# EAGLE schematic raspberry (EAGLE 9.6.2)
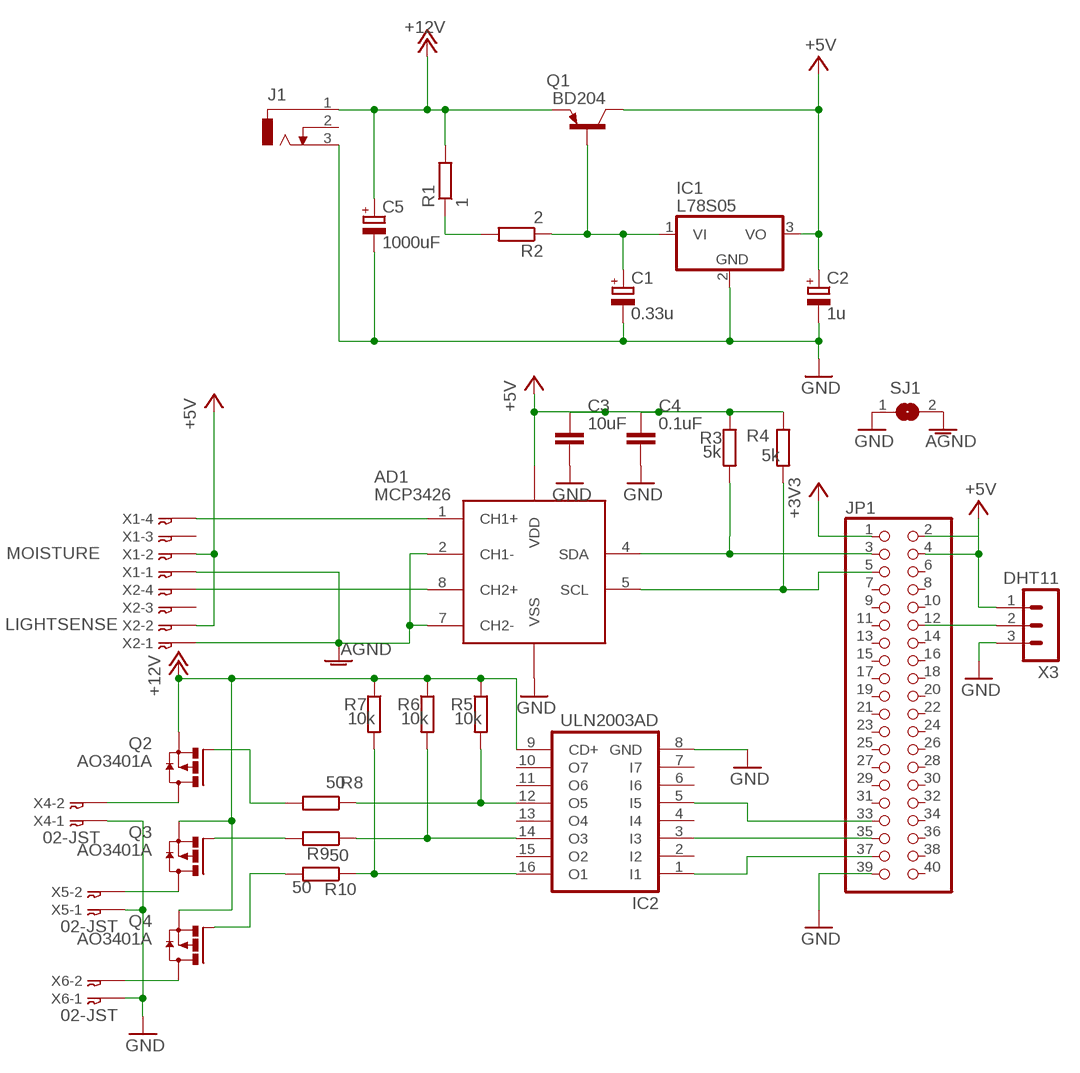
[diagram p0: schematic, sheet 1]

## Parts
AD1  MCP3426  MCP3426A0-E/SN  [SO-8]
C1  0.33u  CPOL-EUE1.8-4  [E1,8-4]
C2  1u  CPOL-EUE2-4  [E2-4]
C3  10uF  C_TANTALUM-1206(3216-METRIC)  [CAPM3216X180]
C4  0.1uF  C_CHIP-0805(2012-METRIC)  [CAPC2012X110]
C5  1000uF  CPOL-EUE5-13  [E5-13]
IC1  L78S05  7805TV  [TO220V]
IC2  ULN2003AD  [SO16]
J1  DCJ0303  [DCJ0303]
JP1  PINHD-2X20  [2X20]
Q1  BD204  -PNP-TO220V  [TO220V]
Q2  AO3401A  [SOT23]
Q3  AO3401A  [SOT23]
Q4  AO3401A  [SOT23]
R1  1  R-EU_R0805W  [R0805W]
R2  2  R-EU_R0805W  [R0805W]
R3  5k  R-EU_R0805W  [R0805W]
R4  5k  R-EU_R0805W  [R0805W]
R5  10k  R-EU_R0805W  [R0805W]
R6  10k  R-EU_R0805W  [R0805W]
R7  10k  R-EU_R0805W  [R0805W]
R8  50  R-EU_R0805W  [R0805W]
R9  50  R-EU_R0805W  [R0805W]
R10  50  R-EU_R0805W  [R0805W]
SJ1  SJ  [SJ]
X1  MOISTURE  04-JST-B4B-XH-A  [B4B-XH]
X2  LIGHTSENSE  04-JST-B4B-XH-A  [B4B-XH]
X3  DHT11  MA03-1  [MA03-1]
X4  02-JST  [B2B-XH]
X5  02-JST  [B2B-XH]
X6  02-JST  [B2B-XH]

## Nets
+3V3: JP1.1
+5V: AD1.3(VDD) C2.+ C3.1 C4.1 IC1.3(VO) JP1.2 JP1.4 Q1.2(C) R3.1 R4.1 X1.P$2 X2.P$2 X3.1
+12V: C5.+ IC2.9(CD+) J1.1 Q1.3(E) Q2.2(S) Q3.2(S) Q4.2(S) R1.2 R5.1 R6.1 R7.1
AGND: AD1.2(CH1-) AD1.7(CH2-) SJ1.2 X1.P$1 X2.P$1
GND: AD1.6(VSS) C1.- C2.- C3.2 C4.2 C5.- IC1.2(GND) IC2.8(GND) J1.3 JP1.39 SJ1.1 X3.3 X4.P$1 X5.P$1 X6.P$1
GPIO18-DHT11-DATA: JP1.12 X3.2
N$1: R1.1 R2.2
N$2: AD1.4(SDA) JP1.3 R3.2
N$3: C1.+ IC1.1(VI) Q1.1(B) R2.1
N$4: AD1.5(SCL) JP1.5 R4.2
N$5: AD1.8(CH2+) X2.P$4
N$6: AD1.1(CH1+) X1.P$4
N$7: IC2.1(I1) JP1.37
N$8: Q3.3(D) X5.P$2
N$9: Q4.3(D) X6.P$2
N$10: IC2.3(I3) JP1.35
N$11: Q2.3(D) X4.P$2
N$12: IC2.16(O1) R7.2 R10.1
N$13: Q2.1(G) R8.2
N$14: IC2.5(I5) JP1.33
N$15: Q3.1(G) R9.2
N$16: IC2.12(O5) R5.2 R8.1
N$17: IC2.14(O3) R6.2 R9.1
N$18: Q4.1(G) R10.2
Unconnected: IC2.2(I2) IC2.4(I4) IC2.6(I6) IC2.7(I7) IC2.10(O7) IC2.11(O6) IC2.13(O4) IC2.15(O2) J1.2 JP1.6 JP1.7 JP1.8 JP1.9 JP1.10 JP1.11 JP1.13 JP1.14 JP1.15 JP1.16 JP1.17 JP1.18 JP1.19 JP1.20 JP1.21 JP1.22 JP1.23 JP1.24 JP1.25 JP1.26 JP1.27 JP1.28 JP1.29 JP1.30 JP1.31 JP1.32 JP1.34 JP1.36 JP1.38 JP1.40 X1.P$3 X2.P$3

## Library data of the parts
AD1 = Custom_Library:MCP3426A0-E/SN
C1 C2 C5 = rcl:CPOL-EU: POLARIZED CAPACITOR, European symbol; SPICEPREFIX: C
C3 C4 = Capacitor:C: Capacitor - Generic; CATEGORY: Capacitor
IC1 = linear:78*: Positive VOLTAGE REGULATOR Source: http://cache.national.com/ds/LM/LM78L05.pdf http://www.fairchildsemi.com/ds/LM/LM7805.pdf
IC2 = uln-udn:ULN2003A: DRIVER ARRAY
J1 = con-jack:DCJ0303: DC POWER JACK Source: DCJ0303.pdf; OC_FARNELL: unknown; OC_NEWARK: unknown
JP1 = pinhead:PINHD-2X20: PIN HEADER
Q1 = transistor:*-PNP-: PNP Transistror
Q2-Q4 = Custom_Library:AO3401A
R1-R10 = rcl:R-EU_: RESISTOR, European symbol; SPICEPREFIX: R
SJ1 = jumper:SJ: SMD solder JUMPER
X1 X2 = bt_con-jst-xh:04-JST: JST CONNECTOR
X3 = con-lstb:MA03-1: PIN HEADER; OC_FARNELL: unknown; OC_NEWARK: unknown
X4-X6 = bt_con-jst-xh:02-JST: JST CONNECTOR